# EasyEDA Pro project ProDoc_tracball7.epro

# Schematic trackball7
Board Name: tracball7; Create Date: 2024-10-23; Page Name: P1; Project Name: miniball; Schematic Name: trackball7; Update Date: 2024-11-02; Company: 嘉立创EDA; Page Size: A4; Version: V1.0
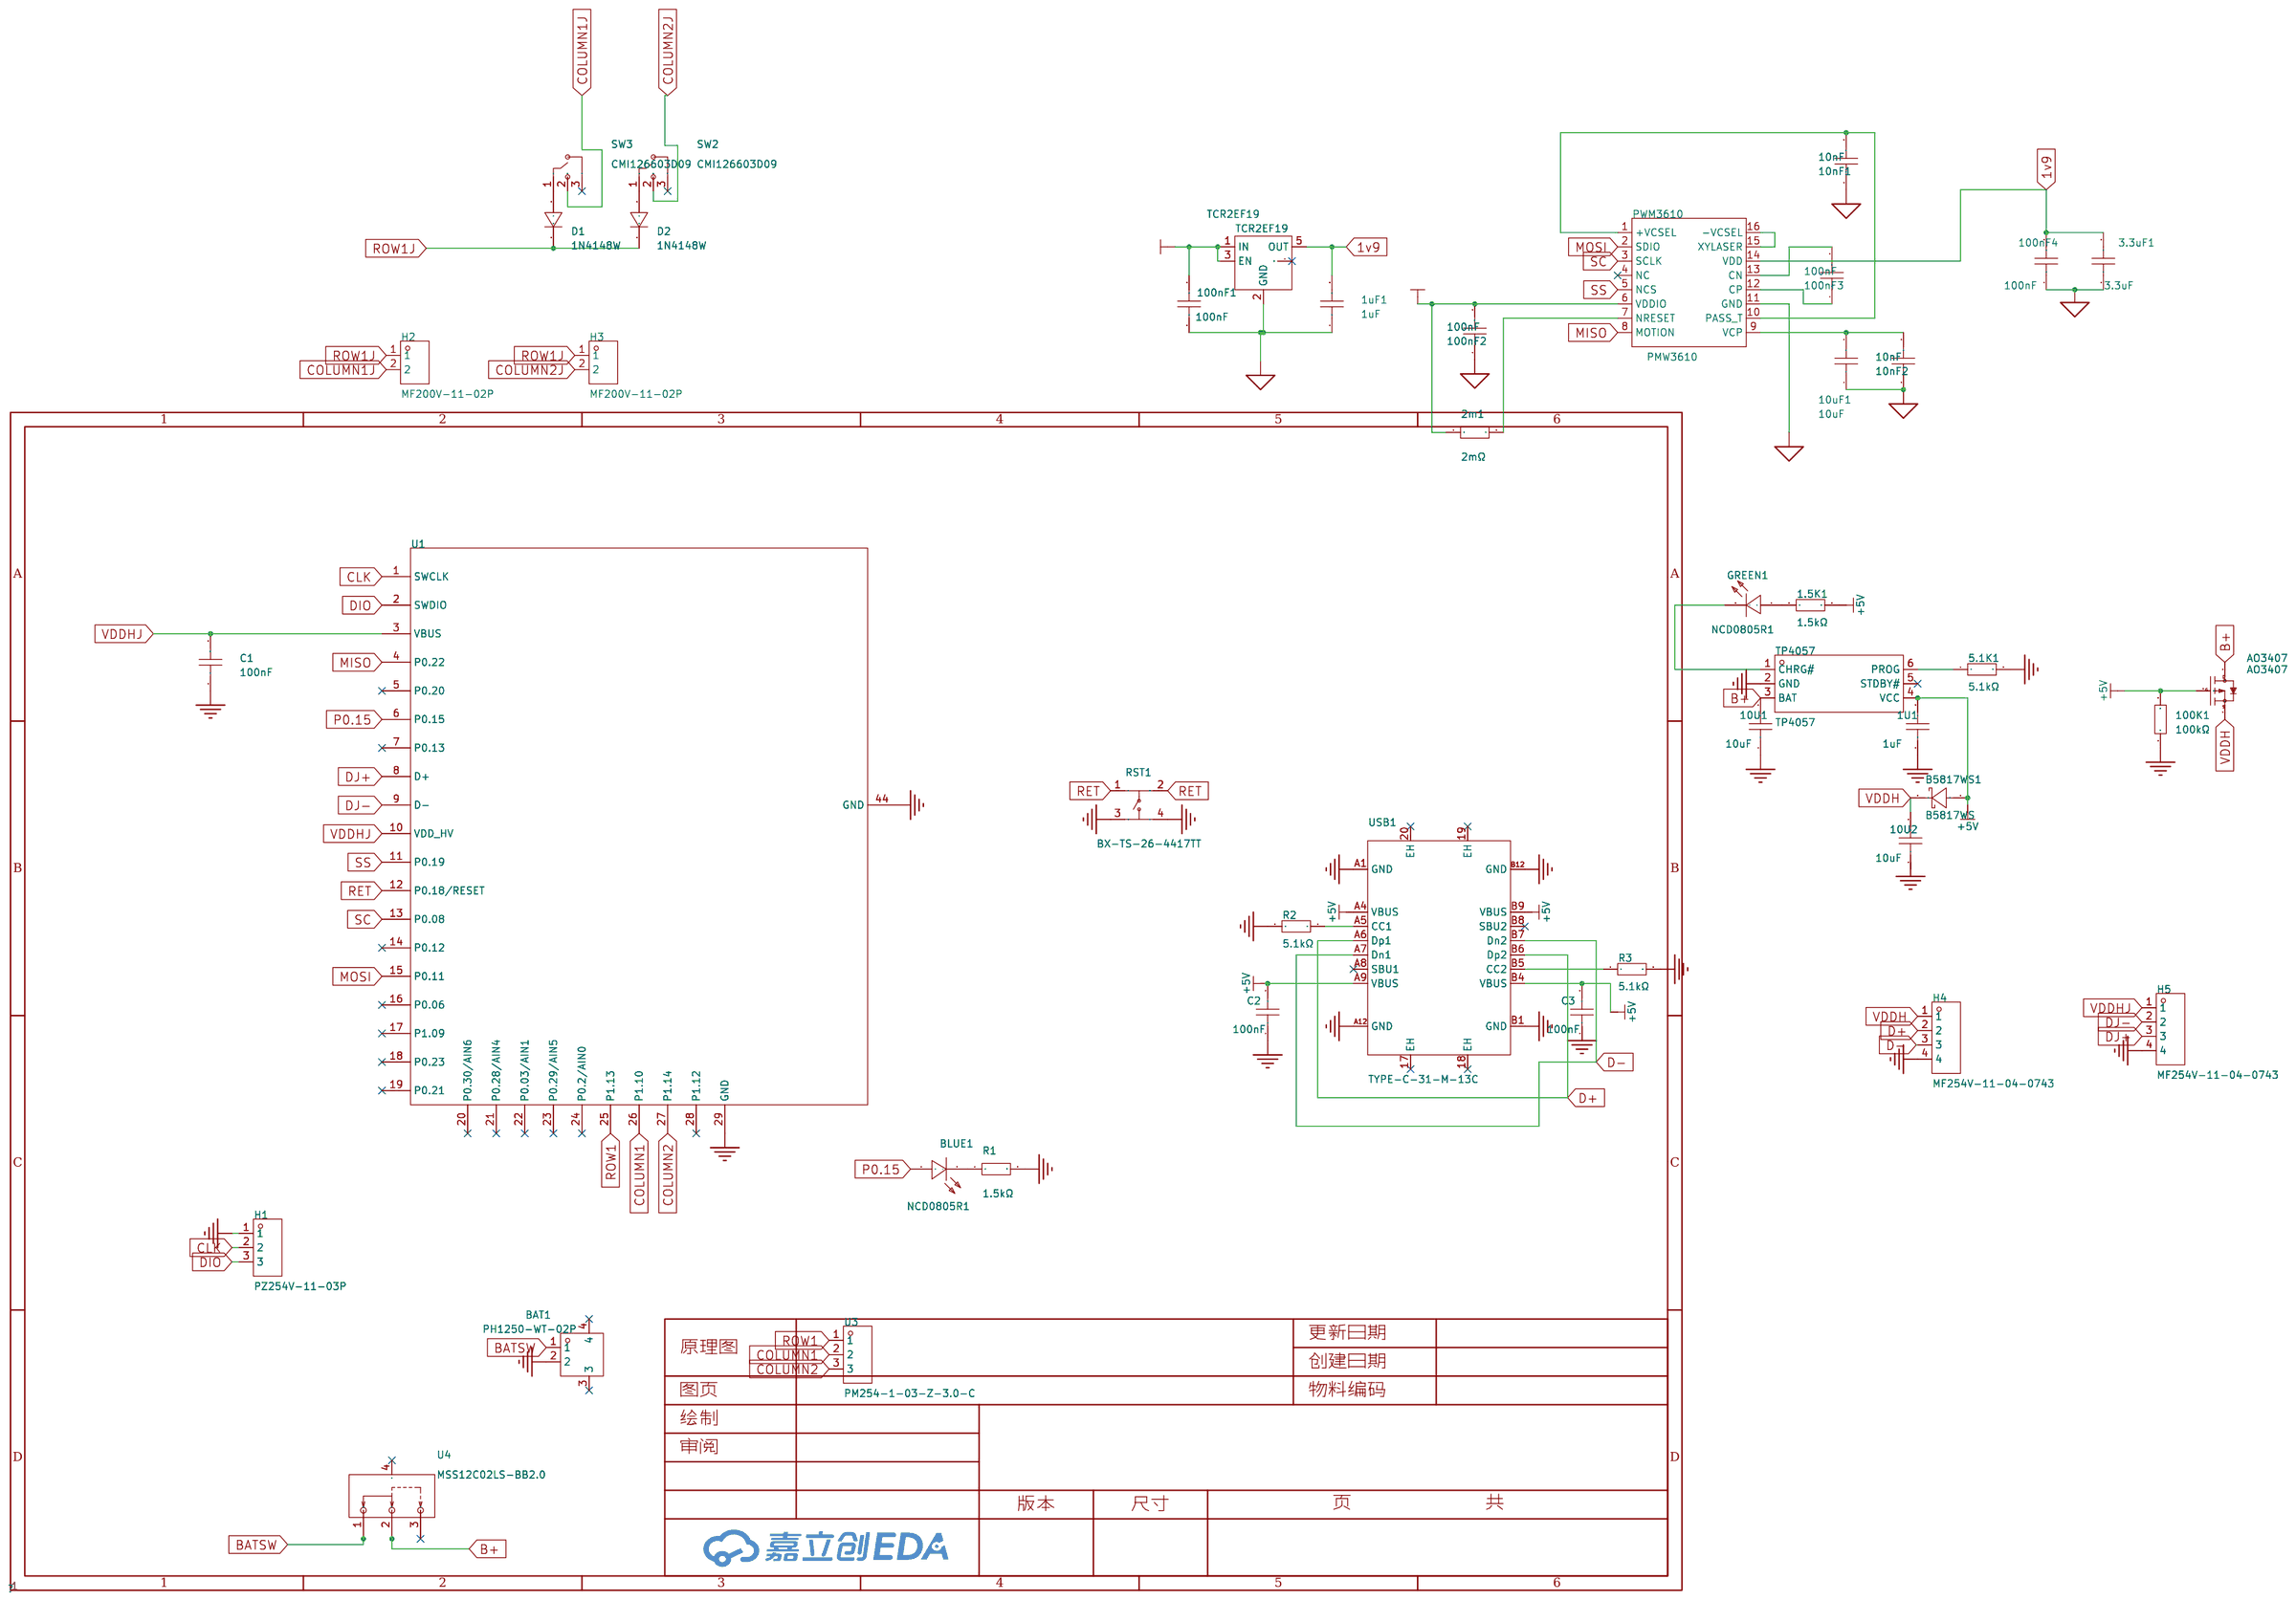
[diagram p0: schematic sheet]

## Parts
1.5K1  1.5kΩ  [R0805]
1U1  1uF  [c0805]
1uF1  1uF  [c0805]
2m1  2mΩ  [R0805]
3.3uF1  3.3uF  [c0805]
5.1K1  5.1kΩ  [R0805]
10nF1  10nF  [c0805]
10nF2  10nF  [c0805]
10U1  10uF  [c0805]
10U2  10uF  [c0805]
10uF1  10uF  [c0805]
100K1  100kΩ  [R0805]
100nF1  100nF  [c0805]
100nF2  100nF  [c0805]
100nF3  100nF  [c0805]
100nF4  100nF  [c0805]
AO3407  AO3407  [SOT-23-3_L2.9-W1.3-P1.90-LS2.4-BR]
B5817WS1  B5817WS  [SOD-323_L1.7-W1.3-LS2.5-FD]
BAT1  PH1250-WT-02P  [CONN-SMD_2P-P1.25-HC-1.25-2PWT]
BLUE1  NCD0805R1  [LED0805-R-RD]
C1  100nF  [C1206]
C2  100nF  [C0603]
C3  100nF  [C0603]
D1  1N4148W  [SOD-123_L2.8-W1.8-LS3.7-RD]
D2  1N4148W  [SOD-123_L2.8-W1.8-LS3.7-RD]
GREEN1  NCD0805R1  [LED0805-R-RD]
H1  PZ254V-11-03P  [HDR-TH_3P-P2.54-V-M]
H2  MF200V-11-02P  [HDR-TH_2P-P2.00-V-F-3]
H3  MF200V-11-02P  [HDR-TH_2P-P2.00-V-F-3]
H4  MF254V-11-04-0743  [HDR-TH_4P-P2.54-V-F_MF254V-11-04-0743]
H5  MF254V-11-04-0743  [HDR-TH_4P-P2.54-V-F_MF254V-11-04-0743]
PWM3610  PMW3610  [mylib:PMW3610]
R1  1.5kΩ  [R1206]
R2  5.1kΩ  [R0805]
R3  5.1kΩ  [R0805]
RST1  BX-TS-26-4417TT  [SW-SMD_4P-L5.2-W5.2-P3.70-LS6.5]
SW2  CMI126603D09  [SW-TH_3P-L12.7-W5.6-P5.08]
SW3  CMI126603D09  [SW-TH_3P-L12.7-W5.6-P5.08]
TCR2EF19  TCR2EF19  [Package_TO_SOT_SMD:SOT-23-5]
TP4057  TP4057  [SOT-23-6_L2.9-W1.6-P0.95-LS2.8-BR]
U1  N52840  [52840MICRO-v1]
U3  PM254-1-03-Z-3.0-C  [HDR-TH_3P-P2.54-V-F-3]
U4  MSS12C02LS-BB2.0  [SW-SMD_MSS12C02LS-HB2.0-1]
USB1  TYPE-C-31-M-13C  [USB-C-SMD_TYPE-C-31-M-13C]

## Library data of the parts
1.5K1 5.1K1 R2 R3 = 0805W8F5101T5E: 电阻类型:厚膜电阻;阻值:5.1kΩ;精度:±1%;功率:125mW;最大工作电压:150V;温度系数:±100ppm/℃;; LCSC Part Name: 5.1kΩ ±1% 125mW 厚膜电阻; Supplier Part: C27834; Manufacturer: UNI-ROYAL(厚声); Supplier Footprint: 0805; JLCPCB Part Class: 基础库; Datasheet: https://atta.szlcsc.com/upload/public/pdf/source/20200306/C422600_1E6D84923E4A46A82E41ADD87F860B5C.pdf; Supplier: LCSC; Type: 厚膜电阻; Tolerance: ±1%; Power(Watts): 125mW; Overload Voltage (Max): 150V; Temperature Coefficient: ±100ppm/℃; Operating Temperature Range: -55℃~+155℃
1U1 10U1 10U2 C2 C3 = CAP_0603: Supplier Footprint: 0603
1uF1 = CL21B105KBFNNNE: 容值:1uF;精度:±10%;额定电压:50V;材质(温度系数):X7R;; LCSC Part Name: 1uF ±10% 50V; Supplier Part: C28323; Manufacturer: SAMSUNG(三星); Supplier Footprint: 0805; JLCPCB Part Class: Basic Part; Datasheet: https://atta.szlcsc.com/upload/public/pdf/source/20160218/1457707763339.pdf; Supplier: LCSC; Tolerance: ±10%; Voltage Rated: 50V; Temperature Coefficient: X7R
2m1 = RLM10FTSMR002: 阻值:2mΩ;精度:±1%;功率:500mW;温度系数:±50ppm/℃;; LCSC Part Name: 2mΩ ±1% 500mW; Supplier Part: C163090; Manufacturer: 大毅科技; Supplier Footprint: 0805; JLCPCB Part Class: Extended Part; Datasheet: https://atta.szlcsc.com/upload/public/pdf/source/20190621/C393099_0FB28B25F89EBDFD36A063D527AB5378.pdf; Supplier: LCSC; Tolerance: ±1%; Power(Watts): 500mW; Temperature Coefficient: ±50ppm/℃
3.3uF1 = 0805B335K160NT: 容值:3.3uF;精度:±10%;额定电压:16V;材质(温度系数):X7R;; LCSC Part Name: 3.3uF ±10% 16V; Supplier Part: C38332; Manufacturer: FH(风华); Supplier Footprint: 0805; JLCPCB Part Class: Extended Part; Datasheet: https://atta.szlcsc.com/upload/public/pdf/source/20200305/C486355_26A10D38EF8C2A5C37091D0039909270.pdf; Supplier: LCSC; Tolerance: ±10%; Voltage Rated: 16V; Temperature Coefficient: X7R
10nF1 10nF2 = CC0805KRX7R9BB103: 容值:10nF;精度:±10%;额定电压:50V;材质(温度系数):X7R;; LCSC Part Name: 10nF ±10% 50V; Supplier Part: C83170; Manufacturer: YAGEO(国巨); Supplier Footprint: 0805; JLCPCB Part Class: Extended Part; Datasheet: https://atta.szlcsc.com/upload/public/pdf/source/20170211/1486785656773.pdf; Supplier: LCSC; Tolerance: ±10%; Voltage Rated: 50V; Temperature Coefficient: X7R
10uF1 = CL21A106KOQNNNE: 容值:10uF;精度:±10%;额定电压:16V;材质(温度系数):X5R;; LCSC Part Name: 10uF ±10% 16V; Supplier Part: C1713; Manufacturer: SAMSUNG(三星); Supplier Footprint: 0805; JLCPCB Part Class: Extended Part; Datasheet: https://atta.szlcsc.com/upload/public/pdf/source/20160218/1457707763339.pdf; Supplier: LCSC; Tolerance: ±10%; Voltage Rated: 16V; Temperature Coefficient: X5R
100K1 = 0805W8F1003T5E: 电阻类型:厚膜电阻;阻值:100kΩ;精度:±1%;功率:125mW;最大工作电压:150V;温度系数:±100ppm/℃;; LCSC Part Name: 100kΩ ±1% 125mW 厚膜电阻; Supplier Part: C149504; Manufacturer: UNI-ROYAL(厚声); Supplier Footprint: 0805; JLCPCB Part Class: Basic Part; Datasheet: https://atta.szlcsc.com/upload/public/pdf/source/20200306/C422600_1E6D84923E4A46A82E41ADD87F860B5C.pdf; Supplier: LCSC; Type: 厚膜电阻; Tolerance: ±1%; Power(Watts): 125mW; Overload Voltage (Max): 150V; Temperature Coefficient: ±100ppm/℃; Operating Temperature Range: -55℃~+155℃
100nF1-100nF4 = 0805B104K500NT: 容值:100nF;精度:±10%;额定电压:50V;材质(温度系数):X7R;; LCSC Part Name: 100nF ±10% 50V; Supplier Part: C38141; Manufacturer: FH(风华); Supplier Footprint: 0805; JLCPCB Part Class: Extended Part; Datasheet: https://atta.szlcsc.com/upload/public/pdf/source/20200305/C486355_26A10D38EF8C2A5C37091D0039909270.pdf; Supplier: LCSC; Tolerance: ±10%; Voltage Rated: 50V; Temperature Coefficient: X7R
AO3407 = AO3407_C181093: 类型:1个P沟道;漏源电压(Vdss):30V;连续漏极电流(Id):4.1A;功率(Pd):350mW;导通电阻(RDS(on)@Vgs,Id):60mΩ@10V,4.1A;阈值电压(Vgs(th)@Id):3V@250uA;; LCSC Part Name: 1个P沟道 耐压:30V 电流:4.1A; Supplier Part: C181093; Manufacturer: Hottech(合科泰); Supplier Footprint: SOT-23; JLCPCB Part Class: 扩展库; Datasheet: https://atta.szlcsc.com/upload/public/pdf/source/20180131/C181093_15173931958531329222.pdf; Supplier: LCSC; Type: 1个P沟道; Drain Source Voltage (Vdss): 30V; Continuous Drain Current (Id): 4.1A; Power Dissipation (Pd): 350mW; Drain Source On Resistance (RDS(on)@Vgs,Id): 60mΩ@10V,4.1A; Gate Threshold Voltage (Vgs(th)@Id): 3V@250uA
B5817WS1 = B5817WS_C7420329: 二极管配置:独立式;正向压降(Vf):450mV@1.0A;直流反向耐压(Vr):20V;平均整流电流(Io):1A;; LCSC Part Name: 电压:20V 电流:1A; Supplier Part: C7420329; Manufacturer: 宏迦橙; Supplier Footprint: SOD-323; JLCPCB Part Class: 扩展库; Datasheet: https://atta.szlcsc.com/upload/public/pdf/source/20230828/03CA0F4F90DAE368A7153B7B5E4D0651.pdf; Supplier: LCSC; Diode Configuration: 独立式; Forward Voltage (Vf@If): 450mV@1.0A; Reverse Voltage (Vr): 20V; Average Rectified Current (Io): 1A; Reverse Leakage Current (Ir): 1mA@20V
BAT1 = PH1250-WT-02P: 插针结构:1x2P;间距:1.25mm;安装方式:卧贴;参考系列:-;总PIN数:2P;排数:1;每排PIN数:2;行距:-;额定电流:-;工作温度范围:-;; Supplier Part: C2939411; Manufacturer: HOOYA(皓宇电子); Supplier Footprint: SMD,P=1.25mm,卧贴; JLCPCB Part Class: 扩展库; Datasheet: https://atta.szlcsc.com/upload/public/pdf/source/20220304/6D997E327DF134438FBFD86825BD1FDF.pdf; Supplier: LCSC; Pins Structure: 1x2P; Pitch: 1.25mm; Mounting Style: 卧贴; Number of Pins: 2P; Number of Rows: 1; Number of PINs Per Row: 2
BLUE1 GREEN1 = NCD0805R1: 灯头类型:-;发光颜色:红色;正向电压(VF):1.6V~2.6V;功率:65mW;正向电流:20mA;主波长:615nm~630nm;二极管配置:独立二极管;透镜颜色:无色透明透镜;色温:-;发光强度:67mcd~195mcd;发光角度:130°;载带方式:-;工作温度:-30℃~+85℃;; Supplier Part: C84256; Manufacturer: 国星光电; Supplier Footprint: 0805; JLCPCB Part Class: 基础库; Datasheet: https://atta.szlcsc.com/upload/public/pdf/source/20200820/C84256_F0A75A43B3EAD75808600A0514C76B99.pdf; Supplier: LCSC; Emitted Color: 红色; Forward Voltage (VF): 1.6V~2.6V; Power Dissipation: 65mW; Forward Current: 20mA; Dominant Wavelength: 615nm~630nm; Diode Configuration: 独立二极管; Lens Color: 无色透明透镜; Luminous Intensity: 67mcd~195mcd; Viewing Angle: 130°; Operating Temperature: -30℃~+85℃
C1 = CC0603KRX7R9BB104: 容值:100nF;精度:±10%;额定电压:50V;材质(温度系数):X7R;; LCSC Part Name: 100nF ±10% 50V; Supplier Part: C14663; Manufacturer: YAGEO(国巨); Supplier Footprint: 0603; JLCPCB Part Class: Basic Part; Datasheet: https://atta.szlcsc.com/upload/public/pdf/source/20180910/C282072_33301C7F631E79921B82A8DAC6BCC5B3.pdf; Supplier: LCSC; Tolerance: ±10%; Voltage Rated: 50V; Temperature Coefficient: X7R
D1 D2 = 1N4148W_C2099: 二极管配置:独立式;正向压降(Vf):1.25V@150mA;直流反向耐压(Vr):100V;平均整流电流(Io):150mA;功率:500mW;反向恢复时间(trr):4ns;; LCSC Part Name: 电压:100V 电流:150mA; Supplier Part: C2099; Manufacturer: CJ(江苏长电/长晶); Supplier Footprint: SOD-123; JLCPCB Part Class: 扩展库; Datasheet: https://atta.szlcsc.com/upload/public/pdf/source/20120428/1457706480199.pdf; Supplier: LCSC; Diode Configuration: 独立式; Forward Voltage (Vf@If): 1.25V@150mA; Reverse Voltage (Vr): 100V; Average Rectified Current (Io): 150mA; Power Dissipation: 500mW; Reverse Leakage Current: 1uA@75V; Reverse Recovery Time (trr): 4ns
H1 = PZ254V-11-03P: 插针结构:1x3P;间距:2.54mm;行距:-;圆针/方针:方针;安装类型:直插;排数:单排;总PIN位数:3P;额定电流:3A;额定电压:250V;配合针长度:6mm;塑高:2.5mm;端接针长度:3mm;工作温度范围:-40℃~+105℃;颜色:黑色;; LCSC Part Name: 间距:2.54mm 1x3P 直插 方针; Supplier Part: C2937625; Manufacturer: XFCN(兴飞); Supplier Footprint: 插件,P=2.54mm; JLCPCB Part Class: Extended Part; Datasheet: https://atta.szlcsc.com/upload/public/pdf/source/20200309/C492402_8335C3D49C4E4C618838D59BB1D024C1.pdf; Supplier: LCSC; Pin Structure: 1x3P; Pitch: 2.54mm; Circluar Pins/Square Pins: 方针; Mounting Type: 直插; Number of Rows: 单排; Number of Pins: 3P; Current Rating (Max): 3A; Voltage Rating (Max): 250V; Length of Mating Pin: 6mm; Insulation Height: 2.5mm; Length of End Connection Pin: 3mm; Operating Temperature Range: -40℃~+105℃; Color: 黑色
H2 H3 = MF200V-11-02P: 插孔结构:1x2P;间距:2mm;行距:-;圆孔/方孔:圆孔;安装类型:直插;排数:单排;总孔位数:2P;额定电流:3A;额定电压:-;插孔方向:顶部;工作温度范围:-40℃~+105℃;; LCSC Part Name: 间距:2mm 1x2P 直插; Supplier Part: C501331; Manufacturer: XFCN(兴飞); Supplier Footprint: 插件,P=2mm; JLCPCB Part Class: 扩展库; Datasheet: https://atta.szlcsc.com/upload/public/pdf/source/20200414/C501331_15EF5154D14F95062AC11A8719FD61A3.pdf; Supplier: LCSC; Holes Structure: 1x2P; Pitch: 2mm; Circular Hole / Square Hole: 圆孔; Mounting Type: 直插; Number of Rows: 单排; Number of Holes: 2P; Current Rating (Max): 3A; Holes Direction: 顶部; Operating Temperature Range: -40℃~+105℃
H4 H5 = MF254V-11-04-0743: 插孔结构:1x4P;间距:2.54mm;行距:-;圆孔/方孔:圆孔;安装类型:直插;排数:单排;总孔位数:4P;额定电流:3A;额定电压:-;插孔方向:顶部;塑高:3mm;工作温度范围:-40℃~+105℃;; LCSC Part Name: 间距:2.54mm 1x4P 直插; Supplier Part: C2889986; Manufacturer: XFCN(兴飞); Supplier Footprint: 插件,P=2.54mm; JLCPCB Part Class: 扩展库; Datasheet: https://atta.szlcsc.com/upload/public/pdf/source/20210903/B90B25BD38C2BCD5781EA63E97C23DE0.pdf; Supplier: LCSC; Holes Structure: 1x4P; Pitch: 2.54mm; Circular Hole / Square Hole: 圆孔; Mounting Type: 直插; Number of Rows: 单排; Number of Holes: 4P; Current Rating (Max): 3A; Holes Direction: 顶部; Insulation Height: 3mm; Operating Temperature Range: -40℃~+105℃
PWM3610 = mysymbol_PMW3610
R1 = 0805W8F1501T5E: 电阻类型:厚膜电阻;阻值:1.5kΩ;精度:±1%;功率:125mW;最大工作电压:150V;温度系数:±100ppm/℃;; LCSC Part Name: 1.5kΩ ±1% 125mW 厚膜电阻; Supplier Part: C4310; Manufacturer: UNI-ROYAL(厚声); Supplier Footprint: 0805; JLCPCB Part Class: 基础库; Datasheet: https://atta.szlcsc.com/upload/public/pdf/source/20200306/C422600_1E6D84923E4A46A82E41ADD87F860B5C.pdf; Supplier: LCSC; Type: 厚膜电阻; Tolerance: ±1%; Power(Watts): 125mW; Overload Voltage (Max): 150V; Temperature Coefficient: ±100ppm/℃; Operating Temperature Range: -55℃~+155℃
RST1 = BX-TS-26-4417TT: 电路结构:单刀单掷;按钮形状:圆形按钮;作用力:260gf;安装方式:立贴;开关长度:4mm;开关宽度:4mm;开关高度:1.7mm;带支架:不带;触点电流:50mA;额定电压(AC):250V;额定电压(DC):12V;绝缘电阻:100MΩ;机械寿命:10万次;; LCSC Part Name: 4x4x1.7铜头开关; Supplier Part: C18078110; Manufacturer: Bossie(博锡); Supplier Footprint: SMD-4P,4x4mm; Datasheet: https://atta.szlcsc.com/upload/public/pdf/source/20231017/916BF7A8DB1936A62562F9A253B59526.pdf; Supplier: LCSC; Circuit: 单刀单掷; Actuator Style: 圆形按钮; Operating Force: 260gf; Mounting Style: 立贴; Switch Length: 4mm; Switch Width: 4mm; Switch Height: 1.7mm; Strike Gundam: 不带; Contact Current: 50mA; Voltage Rating (AC): 250V; Voltage Rating (DC): 12V; Insulation Resistance: 100MΩ; Actuator/Cap Color: 金色; Pin Style: 鸥翼型; Mechanical Life: 10万次; Operating Temperature: -30℃~+80℃
SW2 SW3 = CMI126603D09: 类型:微动开关;电路结构:单刀双掷;额定电流(DC):100mA;额定电压(DC):30V;额定电流(AC):-;额定电压(AC):-;机械寿命:3000万次;; Supplier Part: C400257; Manufacturer: Kailh(凯华); Supplier Footprint: 插件; JLCPCB Part Class: 扩展库; Datasheet: https://atta.szlcsc.com/upload/public/pdf/source/20190626/C400257_E77EDC0EB6AA107463437A33859708E0.pdf; Supplier: LCSC; Type: 微动开关; Circuit: 单刀双掷; Actuator Style: 针状按钮; Contact Current (DC): 100mA; Voltage Rating (DC): 30V; Mechanical Life: 3000万次; Pin Style: PC引脚
TCR2EF19 = Regulator_Linear_TLV70218_SOT23-5: LCSC: C146366
TP4057 = TP4057: 电源电压:6.5V;最大充电电流:500mA;电池类型:锂离子/聚合物;电池节数:1;; Supplier Part: C725791; Manufacturer: UMW(友台半导体); Supplier Footprint: SOT-23-6; JLCPCB Part Class: 扩展库; Datasheet: https://atta.szlcsc.com/upload/public/pdf/source/20231109/7FB39B0490CD1514A6792371FCA0BB30.pdf; Supplier: LCSC; Supply Voltage: 6.5V; Maximum Charge Current: 500mA; Type of Battery: 锂离子/聚合物; Number of Cells: 1; Operating Temperature: -40℃~+85℃
U1 = 52840micro_v1
U3 = PM254-1-03-Z-3.0-C: 插孔结构:1x3P;间距:2.54mm;行距:-;圆孔/方孔:圆孔;安装类型:直插;排数:单排;总孔位数:3P;额定电流:3A;插孔方向:顶部;塑高:3mm;触头材质:黄铜;触头镀层:锡;工作温度范围:-40℃~+105℃;焊接温度(最大值):260℃@10S;; LCSC Part Name: 1x3P 间距:2.54mm 直插; Supplier Part: C5159935; Manufacturer: HCTL(华灿天禄); Supplier Footprint: 插件,P=2.54mm; JLCPCB Part Class: 扩展库; Datasheet: https://atta.szlcsc.com/upload/public/pdf/source/20230609/3F35CA450E3E74609FC35AAE8B198FCB.pdf; Supplier: LCSC; Holes Structure: 1x3P; Pitch: 2.54mm; Circular Hole / Square Hole: 圆孔; Mounting Type: 直插; Number of Rows: 单排; Number of Holes: 3P; Current Rating (Max): 3A; Holes Direction: 顶部; Insulation Height: 3mm; Contact Material: 黄铜; Contact Plating: 锡; Operating Temperature Range: -40℃~+105℃; Soldering Temperature(Max): 260℃@10S
U4 = MSS12C02LS-BB2.0: 电路结构:单刀双掷;安装方式:立贴;开关颜色:-;额定电流(DC):100mA;额定电压(DC):12V;额定电流(AC):-;额定电压(AC):-;机械寿命:1万次;; Supplier Part: C3008585; Manufacturer: SHOU HAN(首韩); Supplier Footprint: SMD; JLCPCB Part Class: 扩展库; Datasheet: https://atta.szlcsc.com/upload/public/pdf/source/20220429/8AEFBC67104491914BC5659DE1F359A3.pdf; Supplier: LCSC; Circuit: 单刀双掷; Pin Style: SMD接片; Switch Length: 6.65mm; Switch Width: 2.75mm; Switch Height: 1.4mm; Mounting Style: 立贴; Current Rating (DC): 100mA; Voltage Rating (DC): 12V; Mechanical Life: 1万次; Operating Temperature: -25℃~+70℃
USB1 = TYPE-C-31-M-13C: 连接器类型:Type-C;标准:-;公母:母;端口数量:1;触点数量:16P;安装方式:沉板;额定电流 - 电源:5A;工作温度范围:-30℃~+80℃;; LCSC Part Name: Type-C 母 沉板; Supplier Part: C2848620; Manufacturer: 韩国韩荣; Supplier Footprint: SMD; JLCPCB Part Class: 扩展库; Datasheet: https://atta.szlcsc.com/upload/public/pdf/source/20210810/4CCDF598433BF097AC090909194D2506.pdf; Supplier: LCSC; Connector Type: Type-C; Gender: 母; Number of Ports: 1; Number of Contacts: 16P; Mounting Style: 沉板; Current Rating - Power (Max): 5A; Operating Temperature Range: -30℃~+80℃

## Nets
1v9: 1uF1.2 3.3uF1.2 100nF4.2 PWM3610.14(VDD) TCR2EF19.5(OUT)
+5V: 1.5K1.2 1U1.2 100K1.2 AO3407.1(G) B5817WS1.1(A) C2.2 C3.2 TP4057.4(VCC) USB1.A4(VBUS) USB1.A9(VBUS) USB1.B4(VBUS) USB1.B9(VBUS)
GND: 1U1.1 1uF1.1 3.3uF1.1 5.1K1.2 10nF1.1 10nF2.1 10U1.1 10U2.1 10uF1.1 100K1.1 100nF1.1 100nF2.1 100nF4.1 BAT1.2 C1.1 C2.1 C3.1 H1.1 H4.4 H5.4 PWM3610.11(GND) R1.2 R2.1 R3.2 RST1.3 RST1.4 TCR2EF19.2(GND) TP4057.2(GND) U1.29(GND) U1.44(GND) USB1.A1(GND) USB1.A12(GND) USB1.B1(GND) USB1.B12(GND)
VCC_EXT: 2m1.1 100nF1.2 100nF2.2 PWM3610.6(VDDIO) TCR2EF19.1(IN) TCR2EF19.3(EN)
VDDH: 10U2.2 AO3407.2(S) B5817WS1.2(K) H4.1
VDDHJ: C1.2 H5.1 U1.3(VBUS) U1.10(VDD_HV)
B+: 10U1.2 AO3407.3(D) TP4057.3(BAT) U4.2
BATSW: BAT1.1 U4.1
CLK: H1.2 U1.1(SWCLK)
COLUMN1: U1.26(P1.10) U3.2
COLUMN1J: H2.2 SW3.2
COLUMN2: U1.27(P1.14) U3.3
COLUMN2J: H3.2 SW2.2
D+: H4.2 USB1.A6(Dp1) USB1.B6(Dp2)
D-: H4.3 USB1.A7(Dn1) USB1.B7(Dn2)
DIO: H1.3 U1.2(SWDIO)
DJ+: H5.3 U1.8(D+)
DJ-: H5.2 U1.9(D-)
MISO: PWM3610.8(MOTION) U1.4(P0.22)
MOSI: PWM3610.2(SDIO) U1.15(P0.11)
P0.15: BLUE1.1(+) U1.6(P0.15)
RET: RST1.1 RST1.2 U1.12(P0.18/RESET)
ROW1: U1.25(P1.13) U3.1
ROW1J: D1.1(K) D2.1(K) H2.1 H3.1
SC: PWM3610.3(SCLK) U1.13(P0.08)
SS: PWM3610.5(NCS) U1.11(P0.19)
$1N3261: PWM3610.15(XYLASER) PWM3610.16(-VCSEL)
$1N4113: D1.2(A) SW3.1
$1N4153: D2.2(A) SW2.1
Net-(1.5K1-1): 1.5K1.1 GREEN1.1(+)
Net-(2m1-2): 2m1.2 PWM3610.7(NRESET)
Net-(5.1K1-1): 5.1K1.1 TP4057.6(PROG)
Net-(10nF1-2): 10nF1.2 PWM3610.1(+VCSEL) PWM3610.10(PASS_T)
Net-(10nF2-2): 10nF2.2 10uF1.2 PWM3610.9(VCP)
Net-(100nF3-1): 100nF3.1 PWM3610.12(CP)
Net-(100nF3-2): 100nF3.2 PWM3610.13(CN)
Net-(BLUE1-2): BLUE1.2(-) R1.1
Net-(GREEN1-2): GREEN1.2(-) TP4057.1(CHRG#)
Net-(R2-2): R2.2 USB1.A5(CC1)
Net-(R3-1): R3.1 USB1.B5(CC2)

Not connected (* = marked no-connect by the designer): BAT1 3* 4*; PWM3610 4(NC)*; SW2 3*; SW3 3*; TCR2EF19 4(NC)*; TP4057 5(STDBY#)*; U1 5(P0.20)* 7(P0.13)* 14(P0.12)* 16(P0.06)* 17(P1.09)* 18(P0.23)* 19(P0.21)* 20(P0.30/AIN6)* 21(P0.28/AIN4)* 22(P0.03/AIN1)* 23(P0.29/AIN5)* 24(P0.2/AIN0)* 28(P1.12)*; U4 3* 4*; USB1 17(EH)* 18(EH)* 19(EH)* 20(EH)* A8(SBU1)* B8(SBU2)*

# Board trackball7
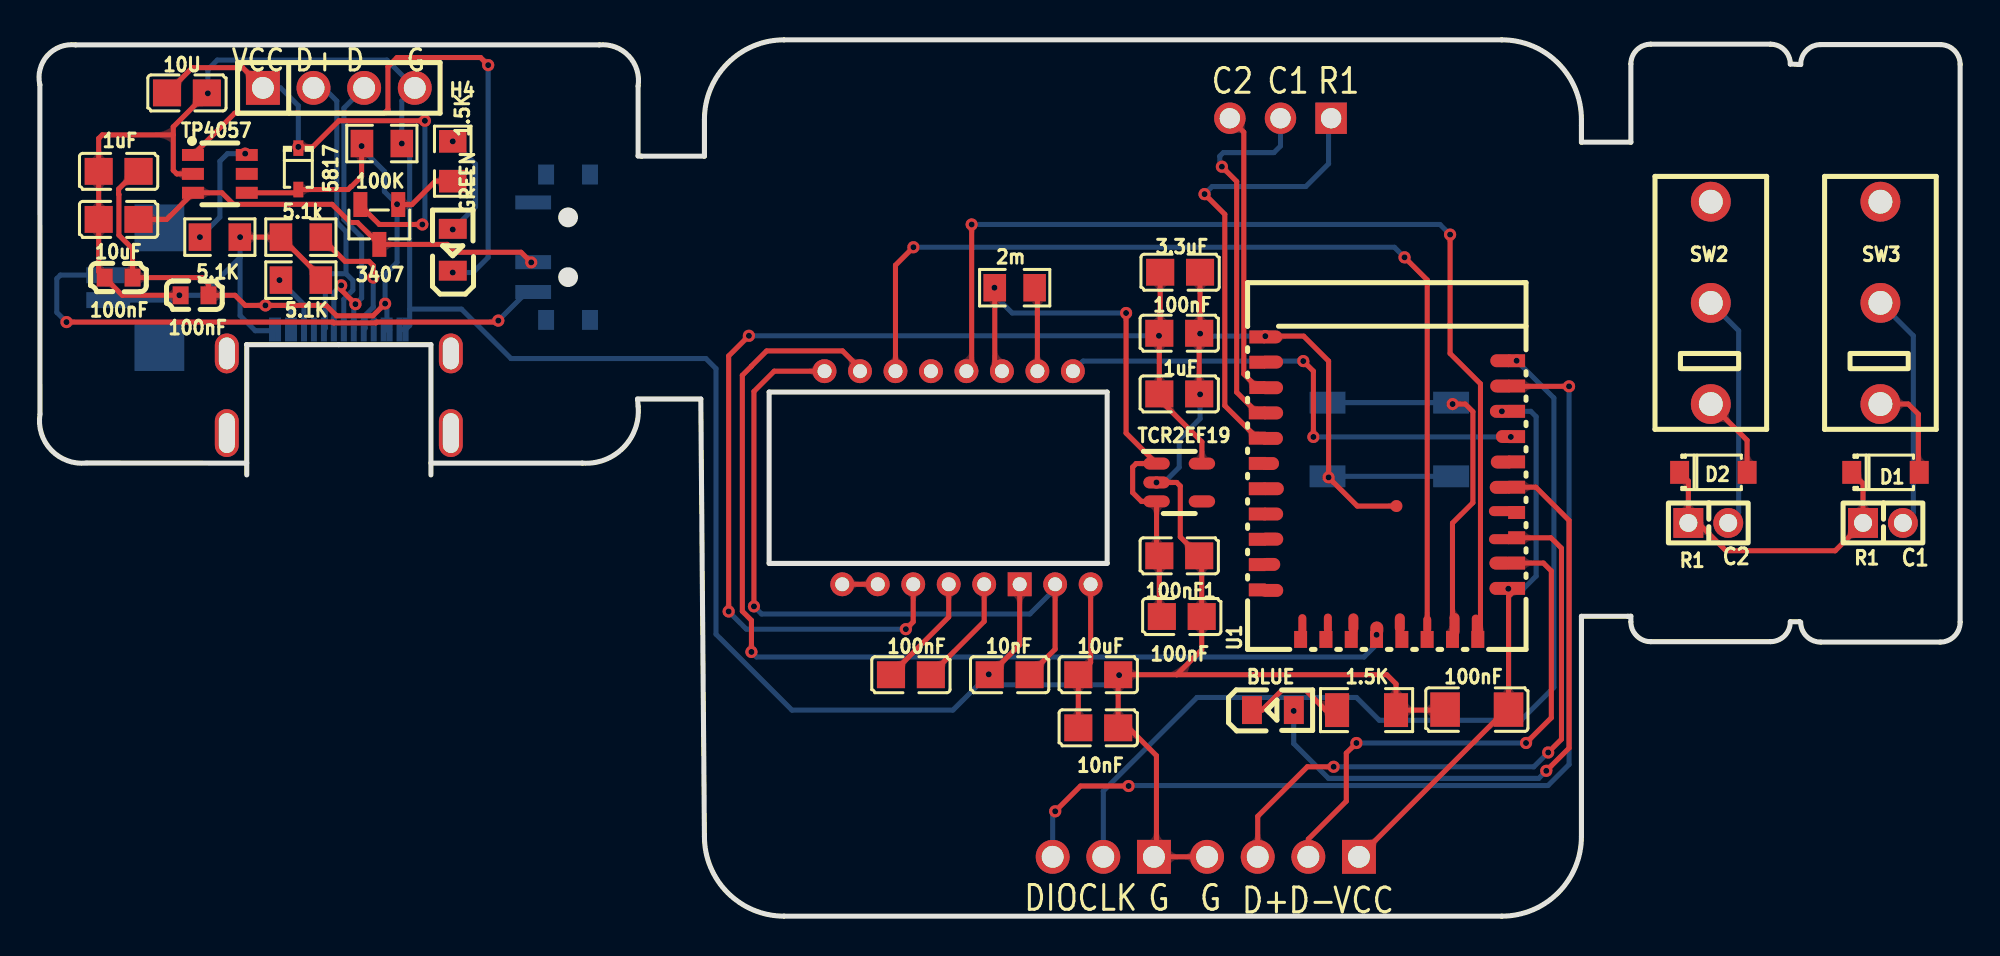
[diagram p1: board, top side]
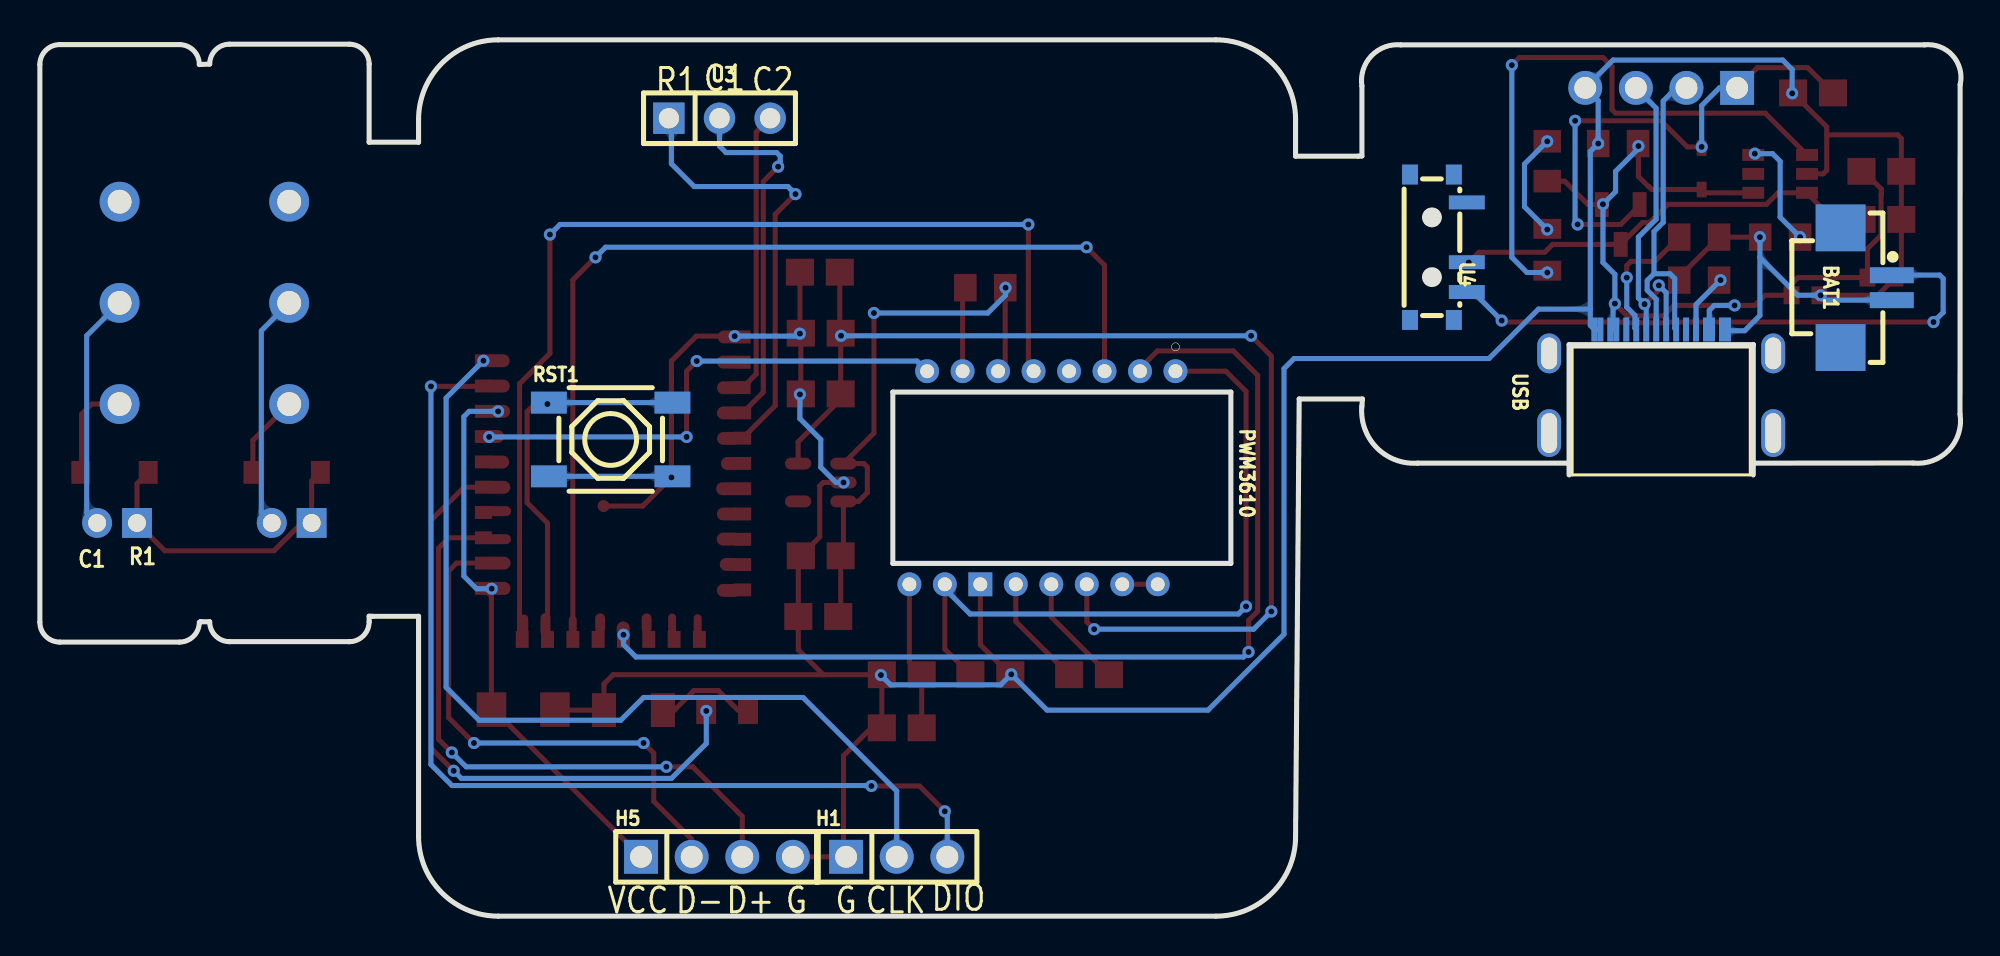
[diagram p2: board, bottom side, seen from below]

Outline 96.34 x 44 mm; copper layers: Top Layer, Bottom Layer. Coordinates in mm from the lower left corner of the outline.
Outline path: 10.38,22.75 2.36,22.75 arc(0.57,23.4) 0.01,25.21 0,41.74 arc(0.38,43.21) 1.79,43.75 28.06,43.75 arc(29.54,43.19) 30.01,41.68 30.01,38.17 30.19,38.16 33.34,38.16 33.34,40 arc(34.51,42.83) 37.34,44 73.34,44 arc(76.17,42.83) 77.34,40 77.34,38.86 79.82,38.86 79.82,42.78 arc(80.11,43.49) 80.82,43.78 86.82,43.78 arc(87.53,43.49) 87.82,42.78 88.34,42.76 arc(88.64,43.47) 89.34,43.76 95.34,43.76 arc(96.05,43.47) 96.34,42.76 96.34,14.76 arc(96.05,14.05) 95.34,13.76 89.34,13.76 arc(88.64,14.05) 88.34,14.76 ; 19.62,22.75 27.22,22.75 arc(29.27,23.52) 30.02,25.6 29.99,25.97 33.16,25.97 33.34,4 arc(34.51,1.17) 37.34,0 73.34,0 arc(76.17,1.17) 77.34,4 77.34,15.06 79.65,15.06 79.82,15.06 79.82,14.78 arc(80.11,14.07) 80.82,13.78 86.82,13.78 arc(87.53,14.07) 87.82,14.78 88.27,14.78 88.28,14.79
Stack: Top Layer 0.035mm / Dielectric1 1.51mm FR4 er 4.5 / Bottom Layer 0.035mm

## Design rules (mm)
template: JLCPCB Capability(Two Layers Board)
spacing copperThickness1oz (default): track to track 0.102, other pairs 0.152 to 0.3
spacing copperThickness2oz: track to track 0.203, other pairs 0.152 to 0.3
track width copperThickness1oz (default): min 0.127, default 0.254, max 2.54
track width copperThickness2oz: min 0.203, default 0.254, max 2.54
differential pair differentialPair (default): width min 0.127, default 0.254, max 2.54; gap min 0.152, default 0.152
via viaSize (default): diameter min 0.5, default 0.61, max 10; hole min 0.3, default 0.305, max 6.3

## Placement (name value [footprint] x y rotation side)
1.5K  -  [R0805]  20.71 37.9 270 top
1.5K#2  -  [R1206]  66.56 10.35 0 top
1uF  -  [c0805]  3.95 37.4 0 top
1uF#2  -  [c0805]  57.16 26.22 180 top
2m  2mΩ  [R0805]  48.91 31.55 0 top
3.3uF  3.3uF  [c0805]  57.21 32.33 180 top
5.1k  5.1kΩ  [R0805]  13.09 34.09 0 top
5.1K  -  [R0805]  13.09 31.94 0 top
5.1K#2  -  [R0805]  9.03 34.09 0 top
10nF  -  [c0805]  48.65 12.12 0 top
10nF#2  -  [c0805]  53.1 9.46 180 top
10U  10uF  [c0805]  7.38 41.33 180 top
10uF  -  [c0805]  53.1 12.12 180 top
10uF#2  -  [c0805]  3.95 34.98 0 top
100K  100kΩ  [R0805]  17.16 38.79 180 top
100nF  -  [C1206]  72.09 10.37 0 top
100nF1  100nF  [c0805]  57.16 18.09 180 top
100nF#2  -  [C0603]  3.95 32.06 0 top
100nF#3  -  [C0603]  7.76 31.17 0 top
100nF#4  -  [c0805]  57.29 15.04 180 top
100nF#5  -  [c0805]  43.7 12.12 180 top
100nF#6  -  [c0805]  57.16 29.27 180 top
3407  AO3407  [SOT-23-3_L2.9-W1.3-P1.90-LS2.4-BR]  17.03 34.73 90 top
5817  B5817WS  [SOD-323_L1.7-W1.3-LS2.5-FD]  12.97 37.52 90 top
BAT1  PH1250-WT-02P  [CONN-SMD_2P-P1.25-HC-1.25-2PWT]  4.71 31.55 270 bottom
BLUE  NCD0805R1  [LED0805-R-RD]  61.86 10.35 0 top
D1  1N4148W  [SOD-123_L2.8-W1.8-LS3.7-RD]  92.6 22.28 0 top
D2  1N4148W  [SOD-123_L2.8-W1.8-LS3.7-RD]  83.96 22.28 0 top
GREEN  NCD0805R1  [LED0805-R-RD]  20.71 33.46 90 top
H1  PZ254V-11-03P  [HDR-TH_3P-P2.54-V-M]  53.35 2.98 180 bottom
H4  MF254V-11-04-0743  [HDR-TH_4P-P2.54-V-F_MF254V-11-04-0743]  15 41.59 0 top
H5  MF254V-11-04-0743  [HDR-TH_4P-P2.54-V-F_MF254V-11-04-0743]  62.37 2.98 180 bottom
PWM3610  PMW3610  [mylib:PMW3610]  39.37 27.36 270 bottom
R1  1.5kΩ  [HDR-TH_2P-P2.00-V-F-3]  92.47 19.74 0 top
R1#2  -  [HDR-TH_2P-P2.00-V-F-3]  83.71 19.74 0 top
RST1  BX-TS-26-4417TT  [SW-SMD_4P-L5.2-W5.2-P3.70-LS6.5]  67.7 23.93 180 bottom
SW2  CMI126603D09  [SW-TH_3P-L12.7-W5.6-P5.08]  83.83 30.79 90 top
SW3  CMI126603D09  [SW-TH_3P-L12.7-W5.6-P5.08]  92.34 30.79 90 top
TCR2EF19  TCR2EF19  [Package_TO_SOT_SMD:SOT-23-5]  57.16 21.78 0 top
TP4057  TP4057  [SOT-23-6_L2.9-W1.6-P0.95-LS2.8-BR]  9.03 37.27 180 top
U1  N52840  [52840MICRO-v1]  74.44 13.39 90 top
U3  PM254-1-03-Z-3.0-C  [HDR-TH_3P-P2.54-V-F-3]  62.24 40.06 180 bottom
U4  MSS12C02LS-BB2.0  [SW-SMD_MSS12C02LS-HB2.0-1]  26.18 33.59 90 bottom
USB  TYPE-C-31-M-13C  [USB-C-SMD_TYPE-C-31-M-13C]  15 26.86 180 bottom

## Footprints (pads in the part's own frame, mm; a bottom-side part is the same pattern mirrored in y, then rotated)
52840MICRO-v1
  oval 0.65x1.2 smd: 1(14.493,1.065) 2(13.223,1.07) 3(11.954,1.085) 5(9.409,1.04) 6(8.139,1.095) 9(4.333,1.109) 10(3.063,1.109) 19(2.963,12.655) 21(5.538,12.655) 22(6.798,12.66) 23(8.069,12.625) 25(10.594,12.67) 26(11.873,12.66) 27(13.139,12.665) 28(14.428,12.66) 29(15.688,12.7)
  rect 0.65x0.85 smd: 1(14.495,0.346) 2(13.225,0.346) 3(11.955,0.346) 4(10.685,0.346) 5(9.415,0.346) 6(8.145,0.346) 7(6.875,0.346) 8(5.605,0.346) 9(4.335,0.346) 10(3.065,0.346) 19(2.988,13.355) 20(4.258,13.355) 21(5.528,13.355) 22(6.798,13.355) 23(8.068,13.355) 24(9.338,13.355) 25(10.608,13.355) 26(11.878,13.355)
  oval 0.65x0.9 smd: 4(10.688,0.934)
  oval 0.5x1.2 smd: 7(6.944,1.135) 8(5.534,1.13)
  rect 0.85x0.65 smd: 11(0.501,2.293) 12(0.501,3.563) 13(0.501,4.833) 14(0.501,6.103) 15(0.501,7.373) 16(0.501,8.643) 17(0.501,9.913) 18(0.501,11.183)
  oval 1x0.4 smd: 11(1.248,2.394) 17(1.298,9.815) 18(1.268,11.095)
  oval 1.2x0.5 smd: 12(1.228,3.459)
  oval 0.9x0.4 smd: 13(1.239,4.83)
  oval 1x0.5 smd: 14(1.308,6.205) 16(1.308,8.534)
  oval 0.8x0.65 smd: 15(1.004,7.359)
  oval 0.65x1 smd: 20(4.269,12.705) 24(9.334,12.765)
  rect 0.65x0.8 smd: 27(13.148,13.355) 28(14.418,13.355) 29(15.688,13.355)
  round 0.6 smd: 44(7.199,6.375)
C0603
  rect 0.8x0.9 smd: 1(-0.7,0) 2(0.7,0)
c0805
  rect 1.41x1.35 smd: 1(-1,0) 2(1,0)
C1206
  rect 1.485x1.728 smd: 1(-1.593,0) 2(1.593,0)
CONN-SMD_2P-P1.25-HC-1.25-2PWT
  rect 0.8x2.2 smd: 1(-0.625,1.285) 2(0.625,1.285)
  rect 2.35x2.5 smd: 3(-3.005,-1.285) 4(3.005,-1.285)
HDR-TH_2P-P2.00-V-F-3
  rect 1.5x1.5 hole 0.9: 1(-1,0)
  round 1.5 hole 0.9: 2(1,0)
HDR-TH_3P-P2.54-V-F-3
  rect 1.575x1.575 hole 1.02: 1(-2.54,0)
  round 1.575 hole 1.02: 2(0,0) 3(2.54,0)
HDR-TH_3P-P2.54-V-M
  rect 1.7x1.7 hole 1.1: 1(-2.54,0)
  round 1.7 hole 1.1: 2(0,0) 3(2.54,0)
HDR-TH_4P-P2.54-V-F_MF254V-11-04-0743
  rect 1.7x1.7 hole 1.1: 1(-3.81,0)
  round 1.7 hole 1.1: 2(-1.27,0) 3(1.27,0) 4(3.81,0)
LED0805-R-RD
  rect 1x1.399 smd: 1(1.05,0) 2(-1.05,0)
mylib:PMW3610
  round 1.2 hole 0.7: 1(0,0) 2(0,-1.78) 3(0,-3.56) 4(0,-5.34) 5(0,-7.12) 6(0,-8.9) 7(0,-10.68) 8(0,-12.46) 9(10.7,-13.35) 10(10.7,-11.57) 12(10.7,-8.01) 13(10.7,-6.23) 14(10.7,-4.45) 15(10.7,-2.67) 16(10.7,-0.89)
  rect 1.2x1.2 hole 0.7: 11(10.7,-9.79)
Package_TO_SOT_SMD:SOT-23-5
  rrect 1.325x0.6 smd: 1(-1.137,0.95) 2(-1.137,0) 3(-1.137,-0.95) 4(1.137,-0.95) 5(1.137,0.95)
R0805
  rect 1.133x1.377 smd: 1(-1,0) 2(1,0)
R1206
  rect 1.208x1.701 smd: 1(-1.479,0) 2(1.479,0)
SOD-123_L2.8-W1.8-LS3.7-RD
  rect 0.95x1.15 smd: 1(-1.692,0) 2(1.692,0)
SOD-323_L1.7-W1.3-LS2.5-FD
  rect 0.78x0.5 smd: 1(-1.04,0) 2(1.04,0)
SOT-23-3_L2.9-W1.3-P1.90-LS2.4-BR
  rect 1.25x0.7 smd: 1(1,-0.95) 2(1,0.95) 3(-1,0)
SOT-23-6_L2.9-W1.6-P0.95-LS2.8-BR
  rect 1.1x0.6 smd: 1(1.35,-0.95) 2(1.35,0) 3(1.35,0.95) 4(-1.35,0.95) 5(-1.35,0) 6(-1.35,-0.95)
SW-SMD_4P-L5.2-W5.2-P3.70-LS6.5
  rect 1.8x1.1 smd: 1(-3.1,1.85) 2(3.1,1.85) 3(-3.1,-1.85) 4(3.1,-1.85)
SW-SMD_MSS12C02LS-HB2.0-1
  rect 0.7x1.8 smd: 1(-2.25,-1.425) 2(-0.75,-1.425) 3(2.25,-1.425)
  rect 1x0.8 smd: 4(-3.65,-0.775) 4(-3.65,1.425) 4(3.65,-0.775) 4(3.65,1.425)
SW-TH_3P-L12.7-W5.6-P5.08
  round 2 hole 1.2: 1(-5.08,0) 2(0,0) 3(5.08,0)
USB-C-SMD_TYPE-C-31-M-13C
  oval 1.2x2 hole 0.8x1.6: 17(5.62,1.4) 20(-5.62,1.4)
  oval 1.2x2.4 hole 0.8x2: 18(5.62,-2.6) 19(-5.62,-2.6)
  rect 0.3x1.2 smd: A1(-3.35,2.6) A4(-2.55,2.6) A5(-1.25,2.6) A6(-0.25,2.6) A7(0.25,2.6) A8(1.25,2.6) A9(2.55,2.6) A12(3.35,2.6) B1(3.05,2.6) B4(2.25,2.6) B5(1.75,2.6) B6(0.75,2.6) B7(-0.75,2.6) B8(-1.75,2.6) B9(-2.25,2.6) B12(-3.05,2.6)

## Nets
1V9: 1uF#2.2 3.3uF.2 100nF#6.2 PWM3610.14 TCR2EF19.5
+5V: 1.5K.2 1uF.2 100K.2 100nF#2.2 100nF#3.2 3407.1 5817.1 TP4057.4 USB.A4 USB.A9 USB.B4 USB.B9
GND: 1.5K#2.2 1uF.1 1uF#2.1 3.3uF.1 5.1k.1 5.1K.2 5.1K#2.2 10nF.1 10nF#2.1 10U.1 10uF.1 10uF#2.1 100K.1 100nF.1 100nF1.1 100nF#2.1 100nF#3.1 100nF#4.1 100nF#6.1 BAT1.2 H1.1 H4.4 H5.4 PWM3610.11 RST1.3 RST1.4 TCR2EF19.2 TP4057.2 U1.29 U1.44 USB.A1 USB.A12 USB.B1 USB.B12
VCC_EXT: 2m.1 100nF1.2 100nF#4.2 PWM3610.6 TCR2EF19.1 TCR2EF19.3
VDDH: 10U.2 3407.2 5817.2 H4.1
VDDHJ: 100nF.2 H5.1 U1.3 U1.10
B+: 10uF#2.2 3407.3 TP4057.3 U4.2
BATSW: BAT1.1 U4.1
CLK: H1.2 U1.1
COLUMN1: U1.26 U3.2
COLUMN1J: R1.2 SW3.2
COLUMN2: U1.27 U3.3
COLUMN2J: R1#2.2 SW2.2
D+: H4.2 USB.A6 USB.B6
D-: H4.3 USB.A7 USB.B7
DIO: H1.3 U1.2
DJ+: H5.3 U1.8
DJ-: H5.2 U1.9
MISO: PWM3610.8 U1.4
MOSI: PWM3610.2 U1.15
P0.15: BLUE.1 U1.6
RET: RST1.1 RST1.2 U1.12
ROW1: U1.25 U3.1
ROW1J: D1.1 D2.1 R1.1 R1#2.1
SC: PWM3610.3 U1.13
SS: PWM3610.5 U1.11
$1N3234: 1.5K#2.1 BLUE.2
$1N3254: 2m.2 PWM3610.7
$1N3257: 10nF#2.2 10uF.2 PWM3610.9
$1N3259: 10nF.2 PWM3610.1 PWM3610.10
$1N3261: PWM3610.15 PWM3610.16
$1N3262: 100nF#5.2 PWM3610.13
$1N3263: 100nF#5.1 PWM3610.12
$1N3272: 5.1K.1 USB.B5
$1N3276: 5.1k.2 USB.A5
$1N3950: 5.1K#2.1 TP4057.6
$1N3956: GREEN.2 TP4057.1
$1N3965: 1.5K.1 GREEN.1
$1N4113: D1.2 SW3.1
$1N4153: D2.2 SW2.1

Pads without a net: BAT1 3 4; PWM3610 4; SW2 3; SW3 3; TCR2EF19 4; TP4057 5; U1 5 7 14 16 17 18 19 20 21 22 23 24 28; U4 3 4; USB 17 18 19 20 A8 B8

## Via types
v1: diameter 0.61, hole 0.305, Top Layer to Bottom Layer, 62 vias

## Routing (per net, layer and track width the routed paths; a pad name or vN(x,y) marks a point on that pad's centre or on a via; arc(x,y) is an arc through that point)
1V9: length 57
  Top Layer w0.254: 56.16,29.16 100nF#6.2 56.21,29.31 3.3uF.2 ; 56.16,29.16 1uF#2.2 56.16,25.95 58.3,23.81 TCR2EF19.5 ; 56.16,29.16 v1(56.15,29.14) ; v1(43.45,14.41) 43.82,14.78 PWM3610.14 ; v1(34.56,15.3) 34.56,28.13 v1(35.57,29.14)
  Bottom Layer w0.254: v1(34.56,15.3) 35.45,14.41 v1(43.45,14.41) ; v1(35.57,29.14) v1(56.15,29.14)
+5V: length 44.5
  Top Layer w0.254: 1uF.2 4.84,37.4 3.95,36.51 3.95,36.25 3.97,36.24 3.97,34.19 4.65,33.51 100nF#2.2 8.14,32.06 8.46,31.74 100nF#3.2 9.79,31.17 10.3,30.67 v1(11.32,30.67) 14.36,30.67 14.89,30.14 16.71,30.14 v1(17.32,30.76) ; 1.5K.2 19.84,36.9 18.67,35.73 3407.1 17.97,35.75 v1(17.92,35.75) ; TP4057.4 12.8,36.32 5817.1 15.47,36.48 15.62,36.63 15.63,36.63 16.14,37.14 v1(16.14,38.67) 16.14,38.78 100K.2
  Bottom Layer w0.254: USB.B9 USB.A4 17.41,29.59 17.41,30.67 v1(17.32,30.76) 17.32,32.23 17.92,32.82 v1(17.92,35.75) 17.29,36.38 17.29,37.4 16.14,38.54 v1(16.14,38.67) ; v1(11.32,30.67) 12.33,30.67 12.59,30.41 12.59,29.59 USB.A9 USB.B4
GND: length 200.1
  Top Layer w0.254: 10uF.1 57.04,12.12 ; 57.04,12.12 67.58,12.12 68.04,11.66 1.5K#2.2 70.48,10.35 100nF.1 ; 57.04,12.12 58.29,13.38 100nF#4.1 58.29,17.97 100nF1.1 57.22,19.04 57.22,21.6 57.04,21.78 TCR2EF19.2 v1(56.02,21.78) ; 5.1K#2.2 v1(10.05,34.09) 5.1k.1 14.09,32.09 5.1K.2 ; 3.3uF.1 58.21,29.31 100nF#6.1 1uF#2.1 ; 100nF#3.1 v1(7,31.17) 4.14,31.17 100nF#2.1 2.95,32.36 10uF#2.1 1uF.1 2.95,39.05 3.13,39.23 6.69,39.23 ; PWM3610.11 49.16,13.63 10nF.1 ; 10U.1 8.38,41.32 6.69,39.63 6.69,37.45 6.87,37.27 TP4057.2 ; v1(54.15,12.1) 54.1,12.06 10nF#2.1 54.62,9.46 56.02,8.06 56.02,3.11 H1.1 H5.4 ; U1.29 61.7,29.12 63.41,29.12 64.66,27.87 v1(64.66,22.03) 66.09,20.59 U1.44
  Bottom Layer w0.254: v1(64.66,22.03) 64.6,22.08 RST1.4 RST1.3 ; v1(61.48,29.12) 58.34,29.12 v1(58.21,29.25) ; v1(58.21,26.2) 58.21,24.98 57.16,23.93 57.16,22.54 56.4,21.78 v1(56.02,21.78) ; 10.05,33.08 8.14,31.17 v1(7,31.17) 6.75,30.93 BAT1.2 ; 10.05,33.08 v1(10.05,34.09) ; 10.05,33.08 10.05,30.16 10.81,29.4 11.59,29.4 USB.A12 USB.B1 ; 18.56,30.48 18.56,29.66 USB.A1 USB.B12 ; 18.56,30.48 21.15,30.48 23.64,28 33.41,28 33.92,27.49 33.92,14.16 37.73,10.35 45.81,10.35 v1(47.61,12.14) 48.14,11.62 53.66,11.62 v1(54.15,12.1) ; 18.56,30.48 18.56,38.4 v1(18.16,38.79) 18.16,40.94 H4.4 17.41,42.98 8.9,42.98 8.43,42.51 v1(8.43,41.31)
VCC_EXT: length 29.7
  Top Layer w0.254: v1(47.89,31.55) 2m.1 47.91,27.72 PWM3610.6 ; v1(54.5,30.28) 54.5,24.26 TCR2EF19.1 55,22.73 54.83,22.55 54.83,21.27 55.27,20.83 TCR2EF19.3 56.03,18.23 100nF1.2 56.16,15.17 100nF#4.2
  Bottom Layer w0.254: v1(47.89,31.55) 47.89,31.17 48.78,30.28 v1(54.5,30.28)
VDDH: length 25.7
  Top Layer w0.254: 10U.2 7.65,42.6 10.17,42.6 H4.1 ; 3407.2 16.08,35.68 17.03,34.73 v1(19.19,34.73) ; v1(19.32,39.94) 15,39.94 13.69,38.62 v1(12.97,38.62)
  Bottom Layer w0.254: v1(12.97,38.62) 12.97,40.7 12.08,41.59 H4.1 ; v1(19.19,34.73) 19.32,34.86 v1(19.32,39.94)
VDDHJ: length 28.3
  Top Layer w0.254: H5.1 73.57,10.37 100nF.2 73.69,16.06 U1.10
  Bottom Layer w0.254: v1(73.35,25.35) 74.8,25.35 75.07,25.08 75.07,17.08 74.44,16.44 v1(73.67,16.44)
B+: length 21.8
  Top Layer w0.254: 10uF#2.2 6.36,34.98 7.68,36.3 TP4057.3 9.14,36.32 9.72,35.74 14.66,35.74 15.58,34.83 15.94,34.83 3407.3 20.44,33.73 20.84,33.33 24.14,33.33 v1(24.65,32.82)
  Bottom Layer w0.254: U4.2 24.74,32.82 v1(24.65,32.82)
BATSW: length 29.1
  Top Layer w0.254: v1(23,29.9) 22.93,29.83 16.9,29.83 16.86,29.79 14.74,29.79 14.7,29.83 v1(1.34,29.83)
  Bottom Layer w0.254: U4.1 24.43,31.34 v1(23,29.9) ; v1(1.34,29.83) 0.85,30.32 0.85,32.01 1.03,32.19 3.42,32.19 BAT1.1
CLK: length 46.2
  Bottom Layer w0.254: H1.2 53.35,6.28 58.05,10.98 66.05,10.98 67.2,9.84 74.31,9.84 75.96,11.49 75.96,26.02 v1(74.09,27.89)
COLUMN1: length 18.3
  Top Layer w0.254: v1(59.3,37.63) 60.05,36.89 60.05,26.31 U1.26
  Bottom Layer w0.254: U3.2 62.24,38.67 61.92,38.34 59.37,38.34 59.2,38.16 59.2,37.74 v1(59.3,37.63)
COLUMN1J: length 11.9
  Bottom Layer w0.254: SW3.2 93.99,29.14 93.99,20.27 R1.2
COLUMN2: length 14.1
  Top Layer w0.254: U3.3 60.4,39.37 60.4,27.22 U1.27
COLUMN2J: length 11.8
  Bottom Layer w0.254: R1#2.2 85.23,20.27 85.23,29.4 SW2.2
D+: length 17.2
  Bottom Layer w0.254: USB.A6 15.25,30.98 15.7,31.43 15.7,31.91 15.36,32.26 ; 15.36,32.26 15.36,34.37 14.9,34.84 14.9,40.93 14.24,41.59 H4.2 ; 15.36,32.26 14.56,32.26 14.32,32.01 14.32,29.53 USB.B6
D-: length 16.7
  Top Layer w0.254: v1(15.83,30.73) 15.12,31.44 v1(15.12,31.67)
  Bottom Layer w0.254: H4.3 15.25,40.57 15.25,34.98 16.14,34.09 16.14,31.04 v1(15.83,30.73) 15.82,30.73 15.75,30.65 USB.B7 ; USB.A7 14.75,31.3 v1(15.12,31.67)
DIO: length 50.7
  Top Layer w0.254: v1(76.72,26.6) 74.11,26.6 U1.2 ; v1(54.62,6.54) 52.21,6.54 v1(50.94,5.27)
  Bottom Layer w0.254: 50.81,2.98 50.81,5.14 v1(50.94,5.27) ; v1(76.72,26.6) 76.72,7.61 75.67,6.56 54.65,6.56 v1(54.62,6.54)
DJ+: length 30.9
  Top Layer w0.254: v1(75.67,8.22) 76.34,8.89 76.34,18.47 75.82,19 U1.8 ; H5.3 61.1,5.01 63.59,7.5 v1(64.91,7.5)
  Bottom Layer w0.254: v1(75.67,8.22) 74.96,7.5 v1(64.91,7.5)
DJ-: length 26.3
  Top Layer w0.254: H5.2 63.64,3.87 65.55,5.77 65.55,8.19 v1(66.05,8.69) ; 74.09,17.73 75.43,17.73 75.83,17.33 75.83,9.96 v1(74.56,8.69)
  Bottom Layer w0.254: v1(74.56,8.69) v1(66.05,8.69)
MISO: length 25.7
  Top Layer w0.254: v1(63.39,27.87) 63.89,27.36 v1(63.89,24.06)
  Bottom Layer w0.254: v1(73.8,24.06) v1(63.89,24.06) ; PWM3610.8 52.34,27.87 v1(63.39,27.87)
MOSI: length 53.2
  Top Layer w0.254: PWM3610.2 41.15,27.5 40.27,28.38 36.46,28.38 35.7,27.62 35.7,27.61 35.24,27.16 35.24,15.31 35.7,14.85 v1(35.7,13.27)
  Bottom Layer w0.254: v1(35.7,13.27) 35.95,13.01 66.43,13.01 67.06,13.64 v1(67.06,14.13)
P0.15: length 31.6
  Top Layer w0.254: v1(75.58,7.3) 76.72,8.44 76.72,19.87 75.05,21.54 U1.6
  Bottom Layer w0.254: v1(75.58,7.3) 75.2,6.92 64.66,6.92 62.91,8.67 v1(62.91,10.31)
RET: length 19.4
  Top Layer w0.254: U1.12 70.87,19.74 71.9,20.76 71.9,25.33 71.51,25.71 v1(70.88,25.71)
  Bottom Layer w0.254: RST1.2 RST1.1 ; RST1.1 70.88,25.71 v1(70.88,25.71) 70.81,25.78 RST1.1
ROW1: length 22.5
  Top Layer w0.254: v1(58.43,36.25) 59.45,35.24 59.45,25.63 U1.25
  Bottom Layer w0.254: U3.1 64.66,39.94 64.66,37.78 63.51,36.63 58.81,36.63 v1(58.43,36.25)
ROW1J: length 15.4
  Top Layer w0.254: D1.1 91.47,21.72 R1.1 90.07,18.35 84.6,18.35 83.2,19.74 R1#2.1 82.71,21.85 D2.1
SC: length 50.4
  Top Layer w0.254: v1(68.47,33.08) 69.61,31.94 U1.13 ; PWM3610.3 42.93,32.69 v1(43.83,33.59)
  Bottom Layer w0.254: v1(43.83,33.59) 67.96,33.59 v1(68.47,33.08)
SS: length 52.7
  Top Layer w0.254: U1.11 72.28,14.03 72.28,26.73 70.75,28.25 v1(70.75,34.22) ; PWM3610.5 46.75,27.63 v1(46.75,34.73)
  Bottom Layer w0.254: v1(46.75,34.73) 70.24,34.73 v1(70.75,34.22)
$1N3234: length 5.1
  Top Layer w0.254: 1.5K#2.1 64.51,10.35 63.53,11.32 62.3,11.32 61.32,10.35 BLUE.2
$1N3254: length 4.2
  Top Layer w0.254: 2m.2 50.05,31.42 PWM3610.7
$1N3257: length 7.5
  Top Layer w0.254: 10nF#2.2 10uF.2 52.72,12.74 PWM3610.9
$1N3259: length 35.8
  Top Layer w0.254: PWM3610.10 50.94,13.41 10nF.2 ; v1(35.83,15.55) 35.83,26.35 36.84,27.36 PWM3610.1
  Bottom Layer w0.254: PWM3610.10 50.94,16.44 49.67,15.17 36.21,15.17 v1(35.83,15.55)
$1N3261: length 1.8
  Top Layer w0.254: PWM3610.16 PWM3610.15
$1N3262: length 5.7
  Top Layer w0.254: PWM3610.13 45.6,15.02 100nF#5.2
$1N3263: length 5.6
  Top Layer w0.254: 100nF#5.1 47.38,14.8 PWM3610.12
$1N3272: length 3
  Bottom Layer w0.254: v1(12.02,31.94) 13.25,30.71 USB.B5
$1N3276: length 6.6
  Top Layer w0.254: 5.1k.2 15.31,32.88 16.51,32.88 16.73,32.67 v1(16.73,32.06)
  Bottom Layer w0.254: USB.A5 16.32,29.53 16.32,30.17 16.73,30.58 v1(16.73,32.06)
$1N3950: length 5.8
  Top Layer w0.254: TP4057.6 10.31,38.29 v1(10.3,38.29)
  Bottom Layer w0.254: v1(8.03,34.09) 9.03,35.09 9.03,37.9 9.41,38.29 v1(10.3,38.29)
$1N3956: length 30.1
  Top Layer w0.254: v1(20.71,32.32) GREEN.2 ; v1(22.49,42.73) 22.11,43.11 17.92,43.11 17.47,42.66 17.47,40.5 17.29,40.32 9.78,40.32 TP4057.1
  Bottom Layer w0.254: v1(22.49,42.73) 22.49,33.08 21.73,32.32 v1(20.71,32.32)
$1N3965: length 5.4
  Top Layer w0.254: v1(20.71,34.48) GREEN.1
  Bottom Layer w0.254: v1(20.71,38.9) 21.86,37.76 21.86,35.62 v1(20.71,34.48)
$1N4113: length 5.1
  Top Layer w0.254: SW3.1 93.74,25.71 94.25,25.2 94.25,22.33 D1.2
$1N4153: length 4.2
  Top Layer w0.254: D2.2 85.65,23.89 SW2.1

## Copper pours and planes (outline as drawn; the poured copper is in the pictures)
GND on Top Layer: -0.75,46.79 100.47,46.79 100.47,-2.35 -0.75,-2.35
GND on Bottom Layer: -0.88,46.92 100.47,46.92 100.47,-2.35 -0.88,-2.35

Small or netless copper shapes (teardrops, artwork), in the pictures only: 176 on Top Layer, 94 on Bottom Layer

## Text on the board
Bottom Silkscreen Layer: R1 | C1 | DIO | CLK | G | C2 | D+ | D- | VCC
Top Silkscreen Layer: C2 | C1 | VCC | D+ | D- | G | R1 | DIO | CLK
